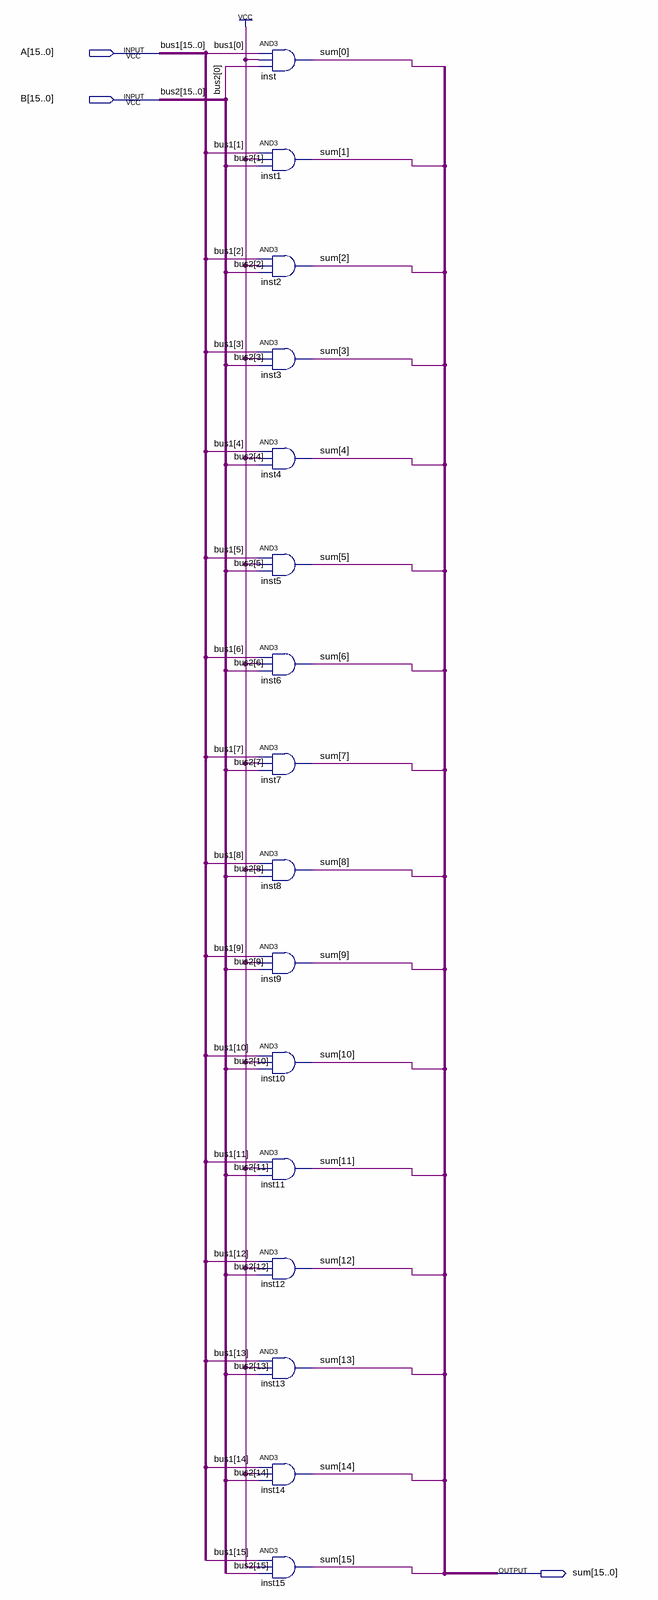
[diagram p0: schematic sheet]
// Quartus schematic ander16bit.bdf as structural Verilog: 16 symbols, 3 pins
module ander16bit (
  input  [15:0] A,
  input  [15:0] B,
  output [15:0] sum
);

  and inst (sum[0], A[0], 1'b1, B[0]);
  and inst1 (sum[1], A[1], 1'b1, B[1]);
  and inst2 (sum[2], A[2], 1'b1, B[2]);
  and inst3 (sum[3], A[3], 1'b1, B[3]);
  and inst4 (sum[4], A[4], 1'b1, B[4]);
  and inst5 (sum[5], A[5], 1'b1, B[5]);
  and inst6 (sum[6], A[6], 1'b1, B[6]);
  and inst7 (sum[7], A[7], 1'b1, B[7]);
  and inst8 (sum[8], A[8], 1'b1, B[8]);
  and inst9 (sum[9], A[9], 1'b1, B[9]);
  and inst10 (sum[10], A[10], 1'b1, B[10]);
  and inst11 (sum[11], A[11], 1'b1, B[11]);
  and inst12 (sum[12], A[12], 1'b1, B[12]);
  and inst13 (sum[13], A[13], 1'b1, B[13]);
  and inst14 (sum[14], A[14], 1'b1, B[14]);
  and inst15 (sum[15], A[15], 1'b1, B[15]);

  // Other names for the same wires on the sheet: bus1[15:0] = A; bus2[15:0] = B
endmodule
